# EAGLE schematic STEP800_proto_r3 (EAGLE 9.5.2)

## Sheet 1 of 3
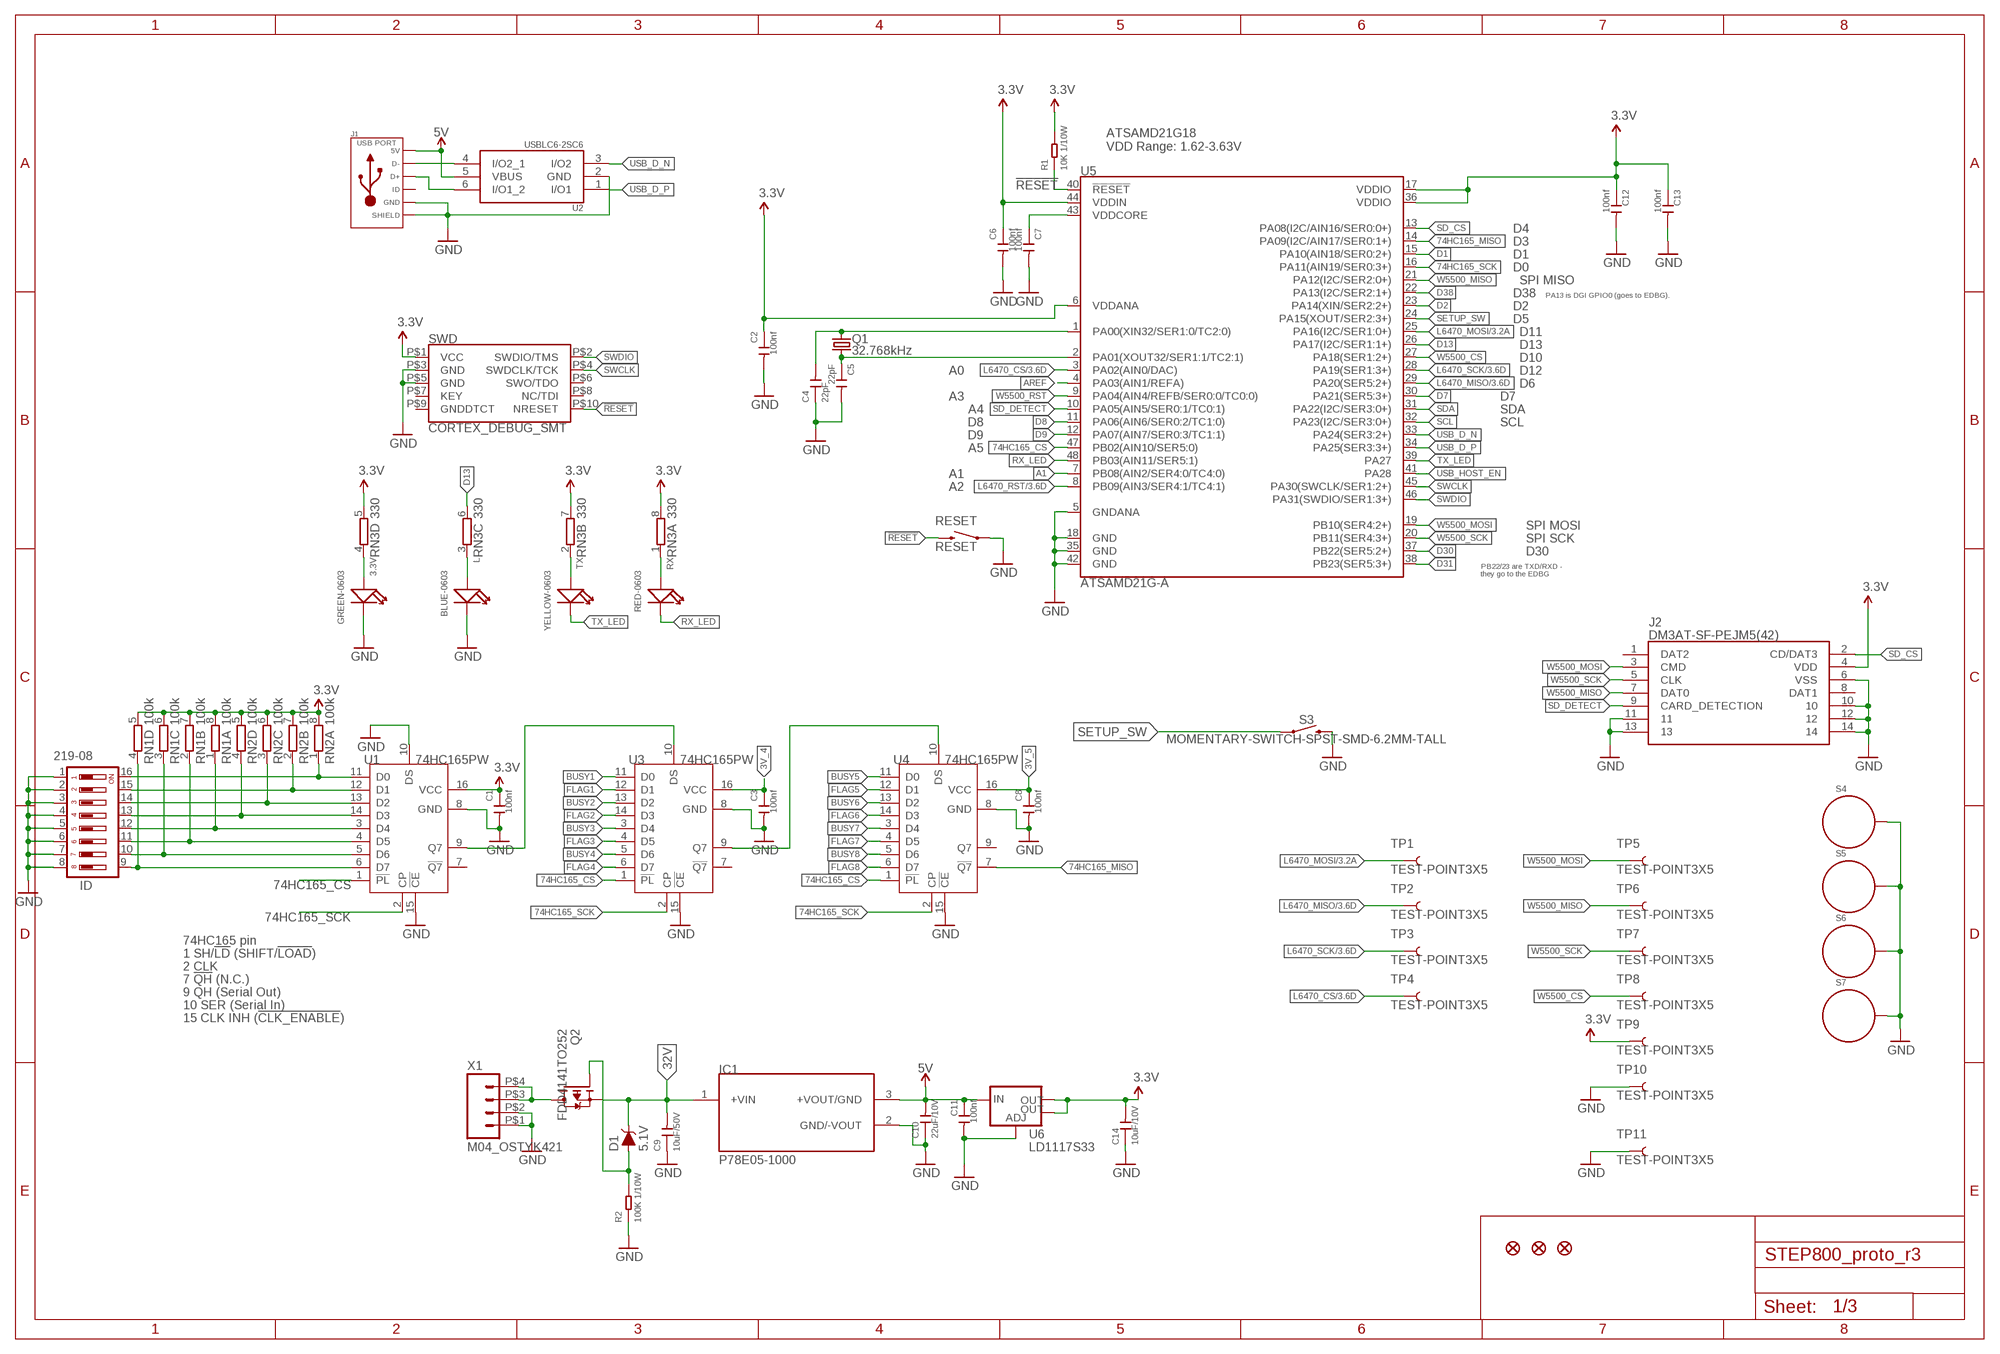
[diagram p0: schematic, sheet 1]

### Parts
3.3V  GREEN-0603  SMD-LED-CLEAR-GREEN(0603)  [LED-0603]
C1  100nf  CERAMIC-100NF-25V-10%-X7R(0402)  [C0402]
C2  100nf  CERAMIC-100NF-25V-10%-X7R(0402)  [C0402]
C3  100nf  CERAMIC-100NF-25V-10%-X7R(0402)  [C0402]
C4  22pF  CERAMIC-15PF-50V-5%-NPO(0402)  [C0402]
C5  22pF  CERAMIC-15PF-50V-5%-NPO(0402)  [C0402]
C6  100nf  CERAMIC-100NF-25V-10%-X7R(0402)  [C0402]
C7  100nf  CERAMIC-100NF-25V-10%-X7R(0402)  [C0402]
C8  100nf  CERAMIC-100NF-25V-10%-X7R(0402)  [C0402]
C9  10uF/50V  CERAMIC-10UF-25V-10%-X5R(1206)  [C1206]
C10  22uF/10V  CERAMIC-22UF-16V-10%-X7R(1206)  [C1206]
C11  100nf  CERAMIC-100NF-25V-10%-X7R(0402)  [C0402]
C12  100nf  CERAMIC-100NF-25V-10%-X7R(0402)  [C0402]
C13  100nf  CERAMIC-100NF-25V-10%-X7R(0402)  [C0402]
C14  10uF/10V  CERAMIC-10UF-10V-(-20%～+80%)-Y5V(0805)  [C0805]
D1  5.1V  DIODE-ZENER-MM3Z3V3T1G  [SOD-323]
FD1  FIDUCIAL1X2  [FIDUCIAL-1X2]
FD2  FIDUCIAL1X2  [FIDUCIAL-1X2]
FD3  FIDUCIAL1X2  [FIDUCIAL-1X2]
IC1  P78E05-1000  [CONV_P78E05-1000]
ID  219-08  [CTS-219-08]
J1  USB_MICRO_10118193-0001LF  [MICROUSB-FCI-PBAN]
J2  DM3AT-SF-PEJM5(42)  [DM3ATSFPEJM542]
L  BLUE-0603  SMD-LED-CLEAR-BLUE(0603)  [LED-0603]
Q1  32.768kHz  CRYSTALFC-135  [FC-135]
Q2  FDD4141TO252  [TO252]
R1  10K 1/10W  SMD-RES-10K-5%-1/10W(0603)  [R0603]
R2  100K 1/10W  SMD-RES-100K-5%-1/10W(0603)  [R0603]
RESET  RESET  SWITCH-MOMENTARY-2SMD  [TACTILE-SWITCH-SMD]
RN1  100k  4R-NCAY16_LONG_W  [CAY16_LONG_W]
RN2  100k  4R-NCAY16_LONG_W  [CAY16_LONG_W]
RN3  330  4R-NCAY16_LONG_W  [CAY16_LONG_W]
RX  RED-0603  LED-SMD-RED-DIFFUSED(0603)  [LED-0603]
S3  MOMENTARY-SWITCH-SPST-SMD-6.2MM-TALL  [TACTILE_SWITCH_SMD_6.2MM_TALL]
S4  STANDOFF_ELECTRICAL  [STANDOFF-ELECTRICAL]
S5  STANDOFF_ELECTRICAL  [STANDOFF-ELECTRICAL]
S6  STANDOFF_ELECTRICAL  [STANDOFF-ELECTRICAL]
S7  STANDOFF_ELECTRICAL  [STANDOFF-ELECTRICAL]
SWD  CORTEX_DEBUG_SMT  [20021121-00010C4LF]
TP1  TEST-POINT3X5  [PAD.03X.05]
TP2  TEST-POINT3X5  [PAD.03X.05]
TP3  TEST-POINT3X5  [PAD.03X.05]
TP4  TEST-POINT3X5  [PAD.03X.05]
TP5  TEST-POINT3X5  [PAD.03X.05]
TP6  TEST-POINT3X5  [PAD.03X.05]
TP7  TEST-POINT3X5  [PAD.03X.05]
TP8  TEST-POINT3X5  [PAD.03X.05]
TP9  TEST-POINT3X5  [PAD.03X.05]
TP10  TEST-POINT3X5  [PAD.03X.05]
TP11  TEST-POINT3X5  [PAD.03X.05]
TX  YELLOW-0603  SMD-LED-CLEAR-YELLOW(0603)  [LED-0603]
U1  74HC165PW  [TSSOP16]
U2  USBLC6-2SC6  [SOT23-6L]
U3  74HC165PW  [TSSOP16]
U4  74HC165PW  [TSSOP16]
U5  ATSAMD21G-A  [TQFP-48]
U6  LD1117S33  V_REG_LM1117SOT223  [SOT223]
X1  M04_OSTYK421  [OSTYK42104030]

### Nets
3.3V [GND_]: C1.1 C2.1 C6.1 C12.1 C13.1 C14.2 J2.4(VDD) R1.2 RN1.5 RN1.6 RN1.7 RN1.8 RN2.5 RN2.6 RN2.7 RN2.8 RN3.5 RN3.7 RN3.8 SWD.P$1(VCC) TP9.P$1 U1.16(VCC) U5.6(VDDANA) U5.17(VDDIO) U5.36(VDDIO) U5.44(VDDIN) U6.2(OUT) U6.4(OUT) ; also sheet 2,3
3V_4 [GND_]: C3.1 U3.16(VCC) ; also sheet 3
3V_5 [GND_]: C8.1 U4.16(VCC) ; also sheet 3
5V: C10.2 C11.1 IC1.3(+VOUT/GND) J1.1(5V) U2.5(VBUS) U6.3(IN) ; also sheet 3
32V: C9.2 D1.C IC1.1(+VIN) Q2.2(S) ; also sheet 3
74HC165_CS: U1.1(!PL) U3.1(!PL) U4.1(!PL) U5.47(PB02(AIN10/SER5:0))
74HC165_MISO: U4.7(!Q7) U5.14(PA09(I2C/AIN17/SER0:1+))
74HC165_SCK: U1.2(CP) U3.2(CP) U4.2(CP) U5.16(PA11(AIN19/SER0:3+))
!RESET: R1.1 RESET.3 SWD.P$10(NRESET) U5.40(!RESET!)
A1: U5.7(PB08(AIN2/SER4:0/TC4:0))
AREF: U5.4(PA03(AIN1/REFA))
BUSY1: U3.11(D0) ; also sheet 3
BUSY2: U3.13(D2) ; also sheet 3
BUSY3: U3.3(D4) ; also sheet 3
BUSY4: U3.5(D6) ; also sheet 3
BUSY5: U4.11(D0) ; also sheet 3
BUSY6: U4.13(D2) ; also sheet 3
BUSY7: U4.3(D4) ; also sheet 3
BUSY8: U4.5(D6) ; also sheet 3
D1: U5.15(PA10(AIN18/SER0:2+))
D2: U5.23(PA14(XIN/SER2:2+))
D7: U5.30(PA21(SER5:3+))
D8: U5.11(PA06(AIN6/SER0:2/TC1:0))
D9: U5.12(PA07(AIN7/SER0:3/TC1:1))
D13: RN3.6 U5.26(PA17(I2C/SER1:1+))
D30: U5.37(PB22(SER5:2+))
D31: U5.38(PB23(SER5:3+))
D38: U5.22(PA13(I2C/SER2:1+))
D+1: J1.3(D+) U2.6(I/O1_2)
FLAG1: U3.12(D1) ; also sheet 3
FLAG2: U3.14(D3) ; also sheet 3
FLAG3: U3.4(D5) ; also sheet 3
FLAG4: U3.6(D7) ; also sheet 3
FLAG5: U4.12(D1) ; also sheet 3
FLAG6: U4.14(D3) ; also sheet 3
FLAG7: U4.4(D5) ; also sheet 3
FLAG8: U4.6(D7) ; also sheet 3
GND: 3.3V.- C1.2 C2.2 C3.2 C4.1 C5.2 C6.2 C7.2 C8.2 C9.1 C10.1 C11.2 C12.2 C13.2 C14.1 IC1.2(GND/-VOUT) ID.1 ID.2 ID.3 ID.4 ID.5 ID.6 ID.7 ID.8 J1.5(GND) J1.S1(SLD) J1.S2(SLD) J1.S3(SLD) J1.S4(SLD) J1.S5(SLD) J1.S6(SLD) J1.S7(SLD) J1.S8(SLD) J2.6(VSS) J2.10 J2.11 J2.12 J2.13 J2.14 L.- R2.1 RESET.1 S3.B2 S4.P1 S5.P1 S6.P1 S7.P1 SWD.P$3(GND) SWD.P$5(GND) TP10.P$1 TP11.P$1 U1.8(GND) U1.10(DS) U1.15(!CE) U2.2(GND) U3.8(GND) U3.15(!CE) U4.8(GND) U4.15(!CE) U5.5(GNDANA) U5.18(GND) U5.35(GND) U5.42(GND) U6.1(ADJ) X1.P$1 X1.P$2 ; also sheet 2,3
L6470_CS: TP4.P$1 U5.3(PA02(AIN0/DAC)) ; also sheet 3
L6470_MISO: TP2.P$1 U5.29(PA20(SER5:2+)) ; also sheet 3
L6470_MOSI: TP1.P$1 U5.25(PA16(I2C/SER1:0+)) ; also sheet 3
L6470_RST: U5.8(PB09(AIN3/SER4:1/TC4:1)) ; also sheet 3
L6470_SCK: TP3.P$1 U5.28(PA19(SER1:3+)) ; also sheet 3
N$3: C4.2 Q1.P$2 U5.1(PA00(XIN32/SER1:0/TC2:0))
N$10: ID.16 RN2.1 U1.11(D0)
N$11: D1.A Q2.1(G) R2.2
N$12: ID.15 RN2.2 U1.12(D1)
N$13: ID.14 RN2.3 U1.13(D2)
N$14: C5.1 Q1.P$1 U5.2(PA01(XOUT32/SER1:1/TC2:1))
N$15: U1.9(Q7) U3.10(DS)
N$16: RN3.1 RX.+
N$17: ID.13 RN2.4 U1.14(D3)
N$18: ID.12 RN1.1 U1.3(D4)
N$19: ID.11 RN1.2 U1.4(D5)
N$25: RN3.2 TX.+
N$26: L.+ RN3.3
N$27: 3.3V.+ RN3.4
N$28: J1.2(D-) U2.4(I/O2_1)
N$33: ID.10 RN1.3 U1.5(D6)
N$34: U3.9(Q7) U4.10(DS)
N$38: ID.9 RN1.4 U1.6(D7)
RX_LED: RX.- U5.48(PB03(AIN11/SER5:1))
SCL: U5.32(PA23(I2C/SER3:0+))
SD_CS: J2.2(CD/DAT3) U5.13(PA08(I2C/AIN16/SER0:0+))
SD_DETECT: J2.9(CARD_DETECTION) U5.10(PA05(AIN5/SER0:1/TC0:1))
SDA: U5.31(PA22(I2C/SER3:0+))
SETUP_SW: S3.A2 U5.24(PA15(XOUT/SER2:3+))
SWCLK: SWD.P$4(SWDCLK/TCK) U5.45(PA30(SWCLK/SER1:2+))
SWDIO: SWD.P$2(SWDIO/TMS) U5.46(PA31(SWDIO/SER1:3+))
TX_LED: TX.- U5.39(PA27)
USB_D_N: U2.3(I/O2) U5.33(PA24(SER3:2+))
USB_D_P: U2.1(I/O1) U5.34(PA25(SER3:3+))
USB_HOST_EN: U5.41(PA28)
VDDCORE1: C7.1 U5.43(VDDCORE)
VRAW: Q2.3(D) X1.P$3 X1.P$4
W5500_CS: TP8.P$1 U5.27(PA18(SER1:2+)) ; also sheet 2
W5500_MISO: J2.7(DAT0) TP6.P$1 U5.21(PA12(I2C/SER2:0+)) ; also sheet 2
W5500_MOSI: J2.3(CMD) TP5.P$1 U5.19(PB10(SER4:2+)) ; also sheet 2
W5500_RST: U5.9(PA04(AIN4/REFB/SER0:0/TC0:0)) ; also sheet 2
W5500_SCK: J2.5(CLK) TP7.P$1 U5.20(PB11(SER4:3+)) ; also sheet 2
Unconnected: J1.4(ID) J2.1(DAT2) J2.8(DAT1) SWD.P$6(SWO/TDO) SWD.P$7(KEY) SWD.P$8(NC/TDI) SWD.P$9(GNDDTCT) U1.7(!Q7) U3.7(!Q7) U4.9(Q7)

### Notes on the sheet
- ATSAMD21G18
  VDD Range: 1.62-3.63V
- D4
- D3
- D1
- D0
- SPI MISO
- D38 | PA13 is DGI GPIO0 (goes to EDBG).
- D2
- D5
- D11
- D13
- D10
- A0 | D12
- D6
- A3 | D7
- A4 | SDA
- D8 | SCL
- D9
- A5
- A1
- A2
- SPI MOSI
- SPI SCK
- D30
- PB22/23 are TXD/RXD - 
  they go to the EDBG
- 74HC165 pin
- 1 SH/!LD! (SHIFT/!LOAD!)
- 2 CLK
- 7 !QH! (N.C.)
- 9 QH (Serial Out)
- 10 SER (Serial In)
- 15 CLK INH (!CLK_ENABLE!)

## Sheet 2 of 3
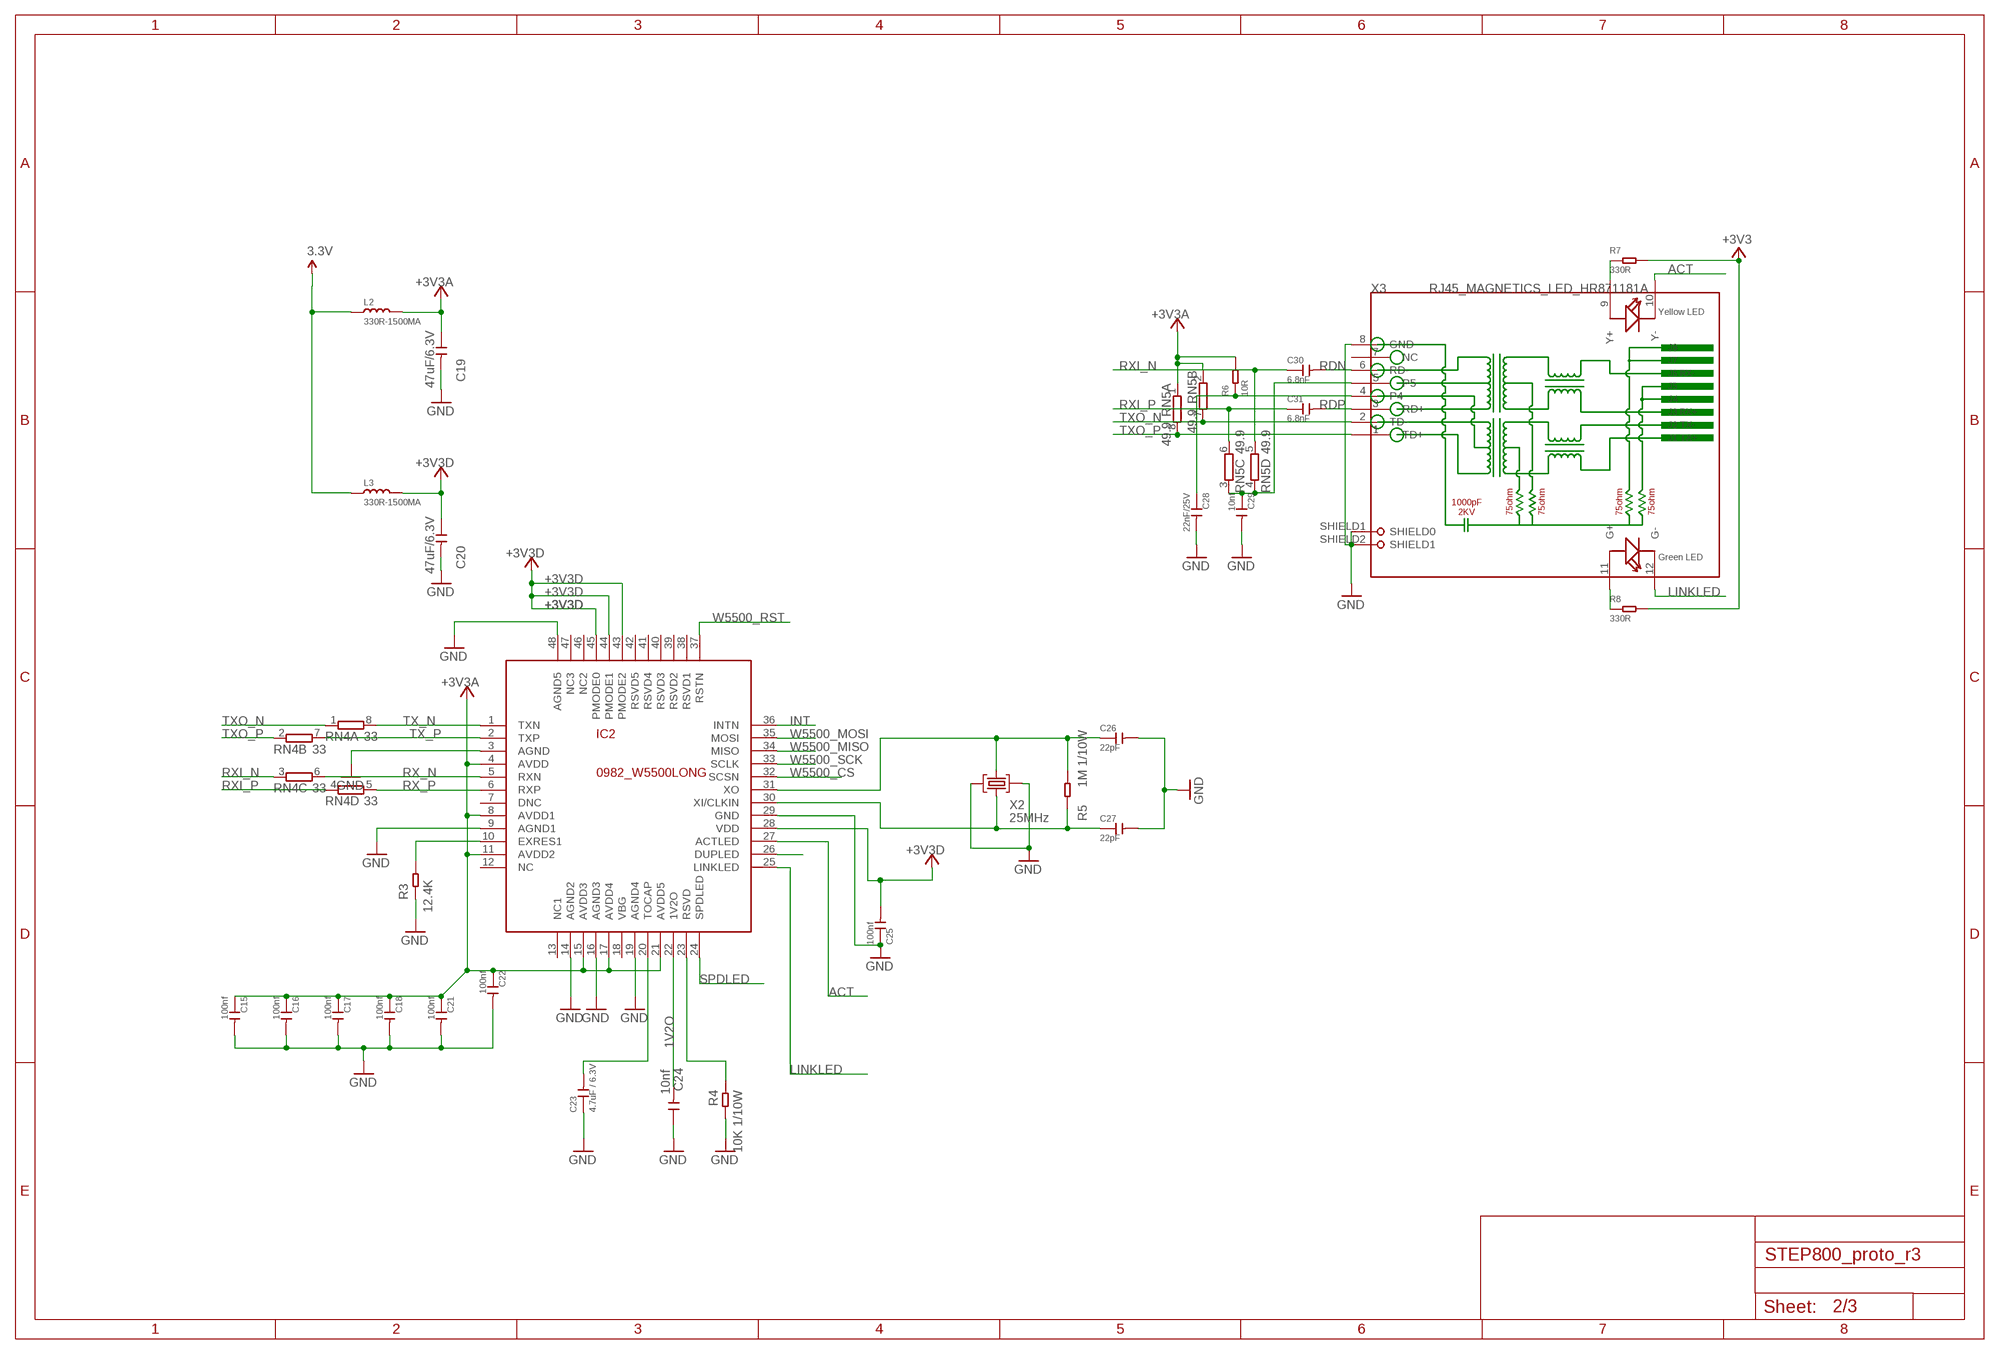
[diagram p1: schematic, sheet 2]

### Parts
C15  100nf  CERAMIC-100NF-25V-10%-X7R(0402)  [C0402]
C16  100nf  CERAMIC-100NF-25V-10%-X7R(0402)  [C0402]
C17  100nf  CERAMIC-100NF-25V-10%-X7R(0402)  [C0402]
C18  100nf  CERAMIC-100NF-25V-10%-X7R(0402)  [C0402]
C19  47uF/6.3V  CERAMIC-100UF-6.3V-20%-X5R(1206)  [C1206]
C20  47uF/6.3V  CERAMIC-100UF-6.3V-20%-X5R(1206)  [C1206]
C21  100nf  CERAMIC-100NF-25V-10%-X7R(0402)  [C0402]
C22  100nf  CERAMIC-100NF-25V-10%-X7R(0402)  [C0402]
C23  4.7uF / 6.3V  CERAMIC-4.7UF-10V-10%-X5R(0603)  [C0603]
C24  10nf  CERAMIC-10NF-50V-10%-X7R(0402)  [C0402]
C25  100nf  CERAMIC-100NF-25V-10%-X7R(0402)  [C0402]
C26  22pF  CERAMIC-15PF-50V-5%-NPO(0402)  [C0402]
C27  22pF  CERAMIC-15PF-50V-5%-NPO(0402)  [C0402]
C28  22nF/25V  CERAMIC-22NF-50V-10%-X7R(0402)  [C0402]
C29  10nf  CERAMIC-10NF-50V-10%-X7R(0402)  [C0402]
C30  6.8nF  CERAMIC-4.7NF-50V-10%-X7R(0402)  [C0402]
C31  6.8nF  CERAMIC-4.7NF-50V-10%-X7R(0402)  [C0402]
IC2  0982_W5500LONG  [TQFP48-LONG]
L2  330R-1500MA  SMD-FERRITE-BEAD-330R-1500MA(0805)'0805'  [L0805]
L3  330R-1500MA  SMD-FERRITE-BEAD-330R-1500MA(0805)'0805'  [L0805]
R3  12.4K  SMD-RES-12K-1%-1/10W(0603)  [R0603]
R4  10K 1/10W  SMD-RES-10K-5%-1/10W(0603)  [R0603]
R5  1M 1/10W  SMD-RES-1M-5%-1/10W(0603)  [R0603]
R6  10R  SMD-RES-10R-5%-1/10W(0603)  [R0603]
R7  330R  SMD-RES-330R-1%-1/10W(0603)  [R0603]
R8  330R  SMD-RES-330R-1%-1/10W(0603)  [R0603]
RN4  33  4R-NCAY16_LONG_W  [CAY16_LONG_W]
RN5  49.9  4R-NCAY16_LONG_W  [CAY16_LONG_W]
X2  25MHz  CRYSTAL-3.2-2.5  [CRYSTAL-3.2-2.5]
X3  RJ45_MAGNETICS_LED_HR871181A  [HR871181A]

### Nets
1V2O: C24.2 IC2.22(1V2O)
3.3V [GND_]: L2.1 L3.1 R7.2 R8.2 ; supply symbol labelled +3V3 ; also sheet 1,3
+3V3A [POWER_]: C15.1 C16.1 C17.1 C18.1 C19.1 C21.1 C22.1 IC2.4(AVDD) IC2.8(AVDD1) IC2.11(AVDD2) IC2.15(AVDD3) IC2.17(AVDD4) IC2.21(AVDD5) L2.2 R6.2 RN5.1 RN5.2
+3V3D: C20.1 C25.2 IC2.28(VDD) IC2.43(PMODE2) IC2.44(PMODE1) IC2.45(PMODE0) L3.2
ACT: IC2.27(ACTLED) X3.10(Y-)
FDXLED1: IC2.26(DUPLED)
GND: C15.2 C16.2 C17.2 C18.2 C19.2 C20.2 C21.2 C22.2 C23.1 C24.1 C25.1 C26.2 C27.2 C28.2 C29.2 IC2.3(AGND) IC2.9(AGND1) IC2.14(AGND2) IC2.16(AGND3) IC2.19(AGND4) IC2.29(GND) IC2.48(AGND5) R3.1 R4.1 X2.2(GND) X2.4(GND) X3.8(GND) X3.SHIELD1(SHIELD0) X3.SHIELD2(SHIELD1) ; also sheet 1,3
INT: IC2.36(INTN)
LINKLED: IC2.25(LINKLED) X3.12(G-)
N$1: C26.1 IC2.31(XO) R5.1 X2.3(C2)
N$2: IC2.23(RSVD) R4.2
N$4: IC2.10(EXRES1) R3.2
N$5: C23.2 IC2.20(TOCAP)
N$6: C28.1 R6.1 X3.4
N$7: C29.1 RN5.3 RN5.4 X3.5
N$8: R7.1 X3.9(Y+)
N$9: R8.1 X3.11(G+)
OSC2E1: C27.1 IC2.30(XI/CLKIN) R5.2 X2.1(C1)
RDN: C30.2 X3.6(RD-)
RDP: C31.2 X3.3(RD+)
RX_N: IC2.5(RXN) RN4.6
RX_P: IC2.6(RXP) RN4.5
RXI_N: C30.1 RN4.3 RN5.5
RXI_P: C31.1 RN4.4 RN5.6
SPDLED: IC2.24(SPDLED)
TX_N: IC2.1(TXN) RN4.8
TX_P: IC2.2(TXP) RN4.7
TXO_N: RN4.1 RN5.7 X3.2(TD-)
TXO_P: RN4.2 RN5.8 X3.1(TD+)
W5500_CS: IC2.32(SCSN) ; also sheet 1
W5500_MISO: IC2.34(MISO) ; also sheet 1
W5500_MOSI: IC2.35(MOSI) ; also sheet 1
W5500_RST: IC2.37(RSTN) ; also sheet 1
W5500_SCK: IC2.33(SCLK) ; also sheet 1
Unconnected: IC2.7(DNC) IC2.13(NC1) IC2.18(VBG) IC2.41(RSVD4) IC2.42(RSVD5) IC2.46(NC2) IC2.47(NC3) X3.7(NC)

## Sheet 3 of 3
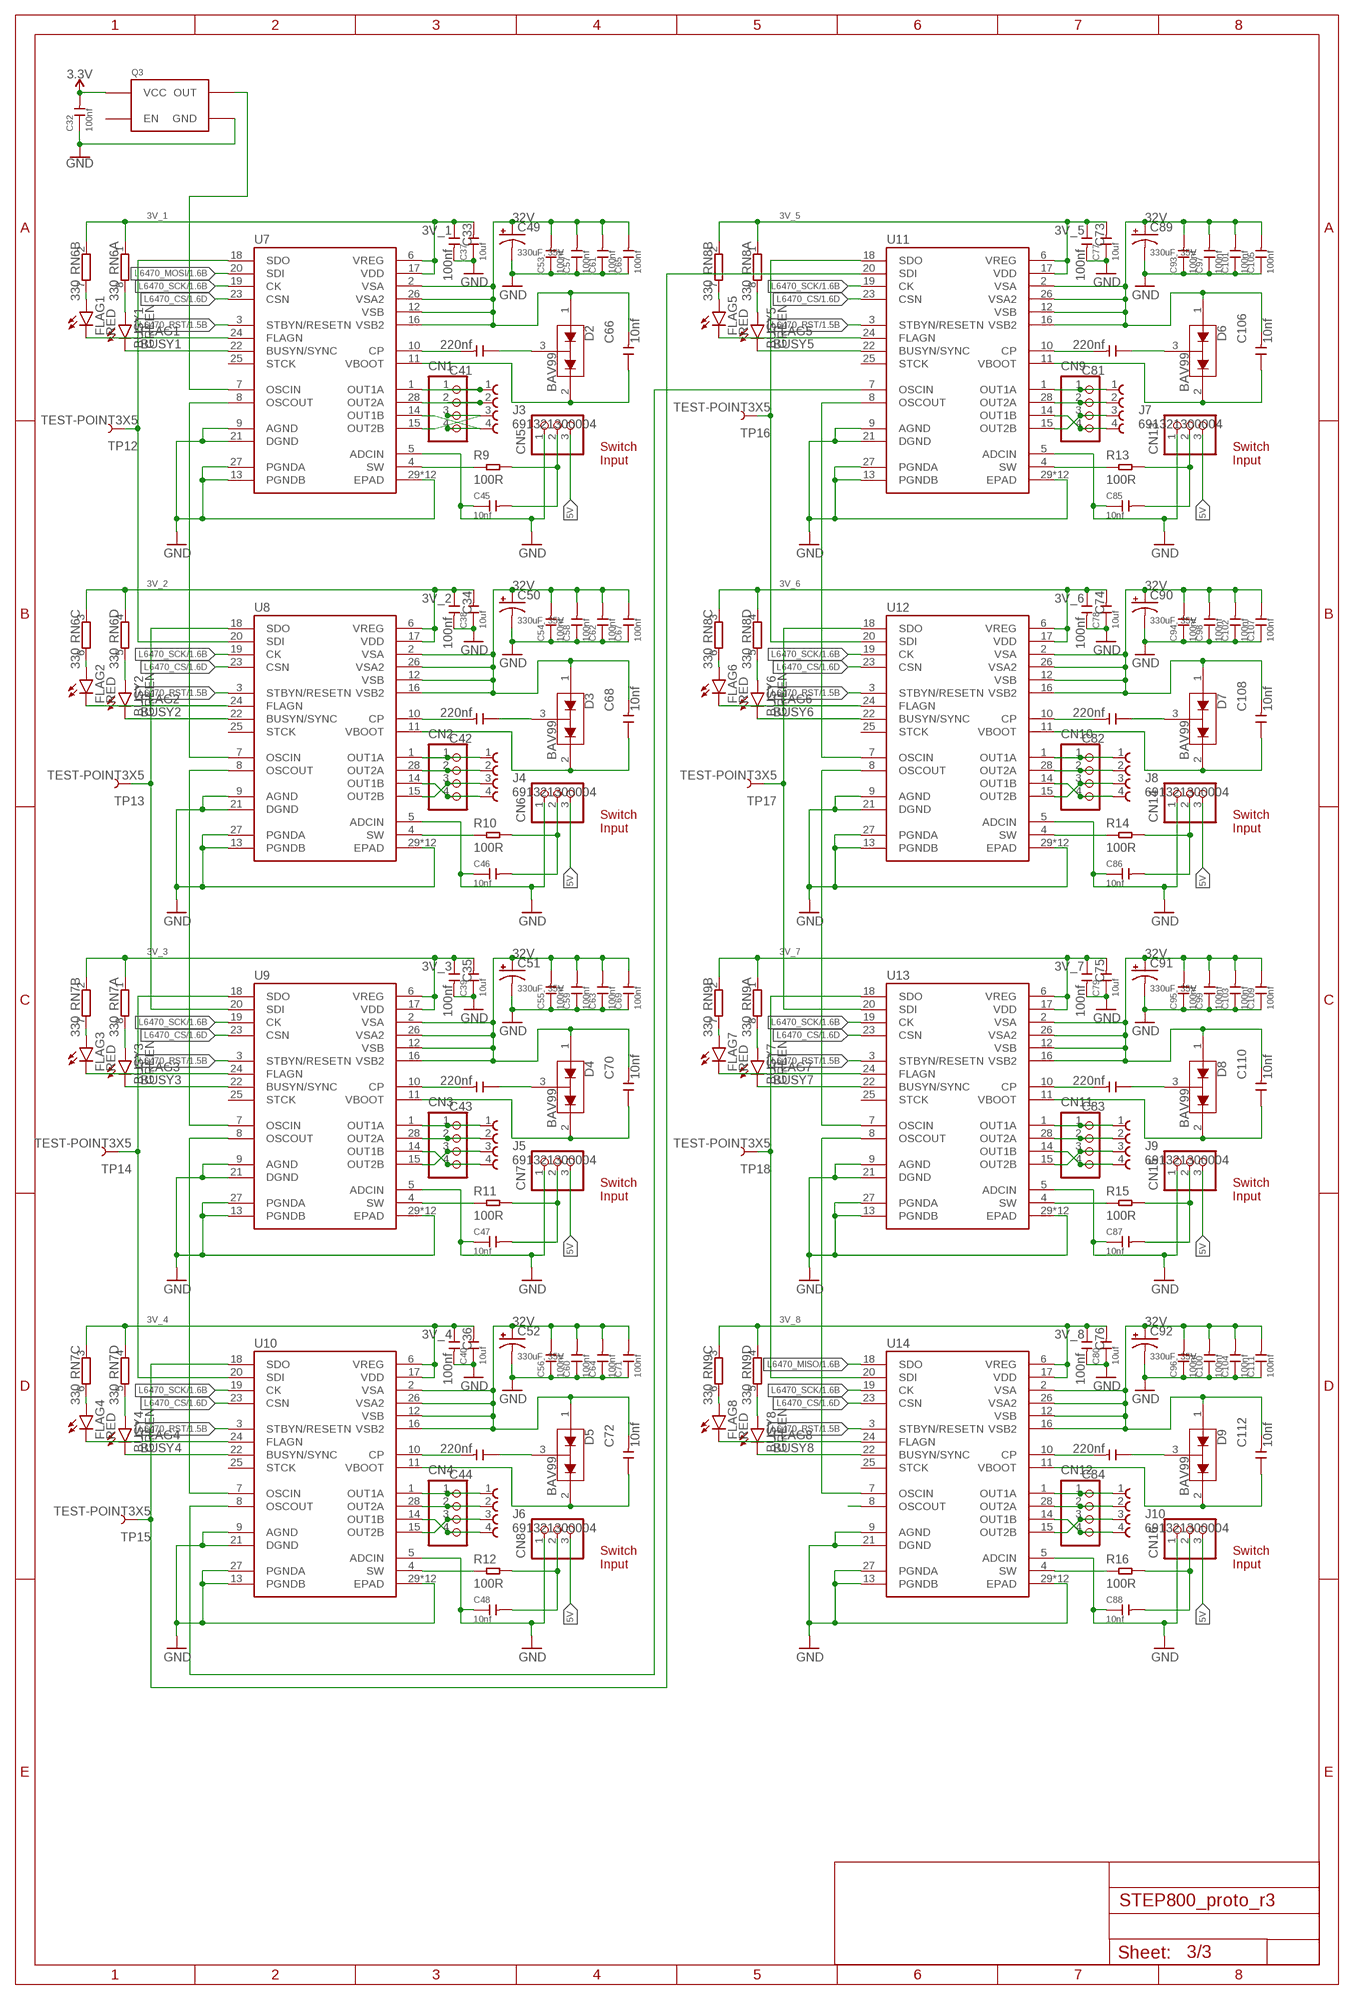
[diagram p2: schematic, sheet 3]

### Parts
BUSY1  GREEN  LED-GREEN0603  [LED-0603]
BUSY2  GREEN  LED-GREEN0603  [LED-0603]
BUSY3  GREEN  LED-GREEN0603  [LED-0603]
BUSY4  GREEN  LED-GREEN0603  [LED-0603]
BUSY5  GREEN  LED-GREEN0603  [LED-0603]
BUSY6  GREEN  LED-GREEN0603  [LED-0603]
BUSY7  GREEN  LED-GREEN0603  [LED-0603]
BUSY8  GREEN  LED-GREEN0603  [LED-0603]
C32  100nf  CERAMIC-100NF-25V-10%-X7R(0402)  [C0402]
C33  100nf  CERAMIC-100NF-25V-10%-X7R(0402)  [C0402]
C34  100nf  CERAMIC-100NF-25V-10%-X7R(0402)  [C0402]
C35  100nf  CERAMIC-100NF-25V-10%-X7R(0402)  [C0402]
C36  100nf  CERAMIC-100NF-25V-10%-X7R(0402)  [C0402]
C37  10uf  CERAMIC-10UF-25V-10%-X5R(0805)  [C0805]
C38  10uf  CERAMIC-10UF-25V-10%-X5R(0805)  [C0805]
C39  10uf  CERAMIC-10UF-25V-10%-X5R(0805)  [C0805]
C40  10uf  CERAMIC-10UF-25V-10%-X5R(0805)  [C0805]
C41  220nf  CERAMIC-220NF-25V-10%-X7R(0603)  [C0603]
C42  220nf  CERAMIC-220NF-25V-10%-X7R(0603)  [C0603]
C43  220nf  CERAMIC-220NF-25V-10%-X7R(0603)  [C0603]
C44  220nf  CERAMIC-220NF-25V-10%-X7R(0603)  [C0603]
C45  10nf  CERAMIC-10NF-50V-10%-X7R(0402)  [C0402]
C46  10nf  CERAMIC-10NF-50V-10%-X7R(0402)  [C0402]
C47  10nf  CERAMIC-10NF-50V-10%-X7R(0402)  [C0402]
C48  10nf  CERAMIC-10NF-50V-10%-X7R(0402)  [C0402]
C49  330uF, 35V  C_POLD10  [NICHICON_D10]
C50  330uF, 35V  C_POLD10  [NICHICON_D10]
C51  330uF, 35V  C_POLD10  [NICHICON_D10]
C52  330uF, 35V  C_POLD10  [NICHICON_D10]
C53  100nf  CERAMIC-100NF-50V-10%-X7R(0603)  [C0603]
C54  100nf  CERAMIC-100NF-50V-10%-X7R(0603)  [C0603]
C55  100nf  CERAMIC-100NF-50V-10%-X7R(0603)  [C0603]
C56  100nf  CERAMIC-100NF-50V-10%-X7R(0603)  [C0603]
C57  100nf  CERAMIC-100NF-50V-10%-X7R(0603)  [C0603]
C58  100nf  CERAMIC-100NF-50V-10%-X7R(0603)  [C0603]
C59  100nf  CERAMIC-100NF-50V-10%-X7R(0603)  [C0603]
C60  100nf  CERAMIC-100NF-50V-10%-X7R(0603)  [C0603]
C61  100nf  CERAMIC-100NF-50V-10%-X7R(0603)  [C0603]
C62  100nf  CERAMIC-100NF-50V-10%-X7R(0603)  [C0603]
C63  100nf  CERAMIC-100NF-50V-10%-X7R(0603)  [C0603]
C64  100nf  CERAMIC-100NF-50V-10%-X7R(0603)  [C0603]
C65  100nf  CERAMIC-100NF-50V-10%-X7R(0603)  [C0603]
C66  10nf  CERAMIC-10NF-50V-10%-X7R(0402)  [C0402]
C67  100nf  CERAMIC-100NF-50V-10%-X7R(0603)  [C0603]
C68  10nf  CERAMIC-10NF-50V-10%-X7R(0402)  [C0402]
C69  100nf  CERAMIC-100NF-50V-10%-X7R(0603)  [C0603]
C70  10nf  CERAMIC-10NF-50V-10%-X7R(0402)  [C0402]
C71  100nf  CERAMIC-100NF-50V-10%-X7R(0603)  [C0603]
C72  10nf  CERAMIC-10NF-50V-10%-X7R(0402)  [C0402]
C73  100nf  CERAMIC-100NF-25V-10%-X7R(0402)  [C0402]
C74  100nf  CERAMIC-100NF-25V-10%-X7R(0402)  [C0402]
C75  100nf  CERAMIC-100NF-25V-10%-X7R(0402)  [C0402]
C76  100nf  CERAMIC-100NF-25V-10%-X7R(0402)  [C0402]
C77  10uf  CERAMIC-10UF-25V-10%-X5R(0805)  [C0805]
C78  10uf  CERAMIC-10UF-25V-10%-X5R(0805)  [C0805]
C79  10uf  CERAMIC-10UF-25V-10%-X5R(0805)  [C0805]
C80  10uf  CERAMIC-10UF-25V-10%-X5R(0805)  [C0805]
C81  220nf  CERAMIC-220NF-25V-10%-X7R(0603)  [C0603]
C82  220nf  CERAMIC-220NF-25V-10%-X7R(0603)  [C0603]
C83  220nf  CERAMIC-220NF-25V-10%-X7R(0603)  [C0603]
C84  220nf  CERAMIC-220NF-25V-10%-X7R(0603)  [C0603]
C85  10nf  CERAMIC-10NF-50V-10%-X7R(0402)  [C0402]
C86  10nf  CERAMIC-10NF-50V-10%-X7R(0402)  [C0402]
C87  10nf  CERAMIC-10NF-50V-10%-X7R(0402)  [C0402]
C88  10nf  CERAMIC-10NF-50V-10%-X7R(0402)  [C0402]
C89  330uF, 35V  C_POLD10  [NICHICON_D10]
C90  330uF, 35V  C_POLD10  [NICHICON_D10]
C91  330uF, 35V  C_POLD10  [NICHICON_D10]
C92  330uF, 35V  C_POLD10  [NICHICON_D10]
C93  100nf  CERAMIC-100NF-50V-10%-X7R(0603)  [C0603]
C94  100nf  CERAMIC-100NF-50V-10%-X7R(0603)  [C0603]
C95  100nf  CERAMIC-100NF-50V-10%-X7R(0603)  [C0603]
C96  100nf  CERAMIC-100NF-50V-10%-X7R(0603)  [C0603]
C97  100nf  CERAMIC-100NF-50V-10%-X7R(0603)  [C0603]
C98  100nf  CERAMIC-100NF-50V-10%-X7R(0603)  [C0603]
C99  100nf  CERAMIC-100NF-50V-10%-X7R(0603)  [C0603]
C100  100nf  CERAMIC-100NF-50V-10%-X7R(0603)  [C0603]
C101  100nf  CERAMIC-100NF-50V-10%-X7R(0603)  [C0603]
C102  100nf  CERAMIC-100NF-50V-10%-X7R(0603)  [C0603]
C103  100nf  CERAMIC-100NF-50V-10%-X7R(0603)  [C0603]
C104  100nf  CERAMIC-100NF-50V-10%-X7R(0603)  [C0603]
C105  100nf  CERAMIC-100NF-50V-10%-X7R(0603)  [C0603]
C106  10nf  CERAMIC-10NF-50V-10%-X7R(0402)  [C0402]
C107  100nf  CERAMIC-100NF-50V-10%-X7R(0603)  [C0603]
C108  10nf  CERAMIC-10NF-50V-10%-X7R(0402)  [C0402]
C109  100nf  CERAMIC-100NF-50V-10%-X7R(0603)  [C0603]
C110  10nf  CERAMIC-10NF-50V-10%-X7R(0402)  [C0402]
C111  100nf  CERAMIC-100NF-50V-10%-X7R(0603)  [C0603]
C112  10nf  CERAMIC-10NF-50V-10%-X7R(0402)  [C0402]
CN1  B4B-XASK-1  [B4B-XASK-1]
CN2  B4B-XASK-1  [B4B-XASK-1]
CN3  B4B-XASK-1  [B4B-XASK-1]
CN4  B4B-XASK-1  [B4B-XASK-1]
CN5  B3B-XASK-1  [B3B-XASK-1]
CN6  B3B-XASK-1  [B3B-XASK-1]
CN7  B3B-XASK-1  [B3B-XASK-1]
CN8  B3B-XASK-1  [B3B-XASK-1]
CN9  B4B-XASK-1  [B4B-XASK-1]
CN10  B4B-XASK-1  [B4B-XASK-1]
CN11  B4B-XASK-1  [B4B-XASK-1]
CN12  B4B-XASK-1  [B4B-XASK-1]
CN13  B3B-XASK-1  [B3B-XASK-1]
CN14  B3B-XASK-1  [B3B-XASK-1]
CN15  B3B-XASK-1  [B3B-XASK-1]
CN16  B3B-XASK-1  [B3B-XASK-1]
D2  BAV99  [SOT23-3]
D3  BAV99  [SOT23-3]
D4  BAV99  [SOT23-3]
D5  BAV99  [SOT23-3]
D6  BAV99  [SOT23-3]
D7  BAV99  [SOT23-3]
D8  BAV99  [SOT23-3]
D9  BAV99  [SOT23-3]
FLAG1  RED  LED-RED0603  [LED-0603]
FLAG2  RED  LED-RED0603  [LED-0603]
FLAG3  RED  LED-RED0603  [LED-0603]
FLAG4  RED  LED-RED0603  [LED-0603]
FLAG5  RED  LED-RED0603  [LED-0603]
FLAG6  RED  LED-RED0603  [LED-0603]
FLAG7  RED  LED-RED0603  [LED-0603]
FLAG8  RED  LED-RED0603  [LED-0603]
J3  691321300004  [691321300004]
J4  691321300004  [691321300004]
J5  691321300004  [691321300004]
J6  691321300004  [691321300004]
J7  691321300004  [691321300004]
J8  691321300004  [691321300004]
J9  691321300004  [691321300004]
J10  691321300004  [691321300004]
Q3  CRYSTAL_OSC_SG5032  [SG5032]
R9  100R  SMD-RES-100R-5%-1/10W(0603)  [R0603]
R10  100R  SMD-RES-100R-5%-1/10W(0603)  [R0603]
R11  100R  SMD-RES-100R-5%-1/10W(0603)  [R0603]
R12  100R  SMD-RES-100R-5%-1/10W(0603)  [R0603]
R13  100R  SMD-RES-100R-5%-1/10W(0603)  [R0603]
R14  100R  SMD-RES-100R-5%-1/10W(0603)  [R0603]
R15  100R  SMD-RES-100R-5%-1/10W(0603)  [R0603]
R16  100R  SMD-RES-100R-5%-1/10W(0603)  [R0603]
RN6  330  4R-NCAY16_LONG_W  [CAY16_LONG_W]
RN7  330  4R-NCAY16_LONG_W  [CAY16_LONG_W]
RN8  330  4R-NCAY16_LONG_W  [CAY16_LONG_W]
RN9  330  4R-NCAY16_LONG_W  [CAY16_LONG_W]
TP12  TEST-POINT3X5  [PAD.03X.05]
TP13  TEST-POINT3X5  [PAD.03X.05]
TP14  TEST-POINT3X5  [PAD.03X.05]
TP15  TEST-POINT3X5  [PAD.03X.05]
TP16  TEST-POINT3X5  [PAD.03X.05]
TP17  TEST-POINT3X5  [PAD.03X.05]
TP18  TEST-POINT3X5  [PAD.03X.05]
U7  L6470_THERMALVIA  [HTSSOP28_VIA]
U8  L6470_THERMALVIA  [HTSSOP28_VIA]
U9  L6470_THERMALVIA  [HTSSOP28_VIA]
U10  L6470_THERMALVIA  [HTSSOP28_VIA]
U11  L6470_THERMALVIA  [HTSSOP28_VIA]
U12  L6470_THERMALVIA  [HTSSOP28_VIA]
U13  L6470_THERMALVIA  [HTSSOP28_VIA]
U14  L6470_THERMALVIA  [HTSSOP28_VIA]

### Nets
3.3V [GND_]: C32.2 Q3.4(VCC) ; also sheet 1,2
3V_1 [GND_]: C33.1 C37.2 RN6.1 RN6.2 U7.6(VREG) U7.17(VDD)
3V_2 [GND_]: C34.1 C38.2 RN6.3 RN6.4 U8.6(VREG) U8.17(VDD)
3V_3 [GND_]: C35.1 C39.2 RN7.1 RN7.2 U9.6(VREG) U9.17(VDD)
3V_4 [GND_]: C36.1 C40.2 RN7.3 RN7.4 U10.6(VREG) U10.17(VDD) ; also sheet 1
3V_5 [GND_]: C73.1 C77.2 RN8.1 RN8.2 U11.6(VREG) U11.17(VDD) ; also sheet 1
3V_6 [GND_]: C74.1 C78.2 RN8.3 RN8.4 U12.6(VREG) U12.17(VDD)
3V_7 [GND_]: C75.1 C79.2 RN9.1 RN9.2 U13.6(VREG) U13.17(VDD)
3V_8 [GND_]: C76.1 C80.2 RN9.3 RN9.4 U14.6(VREG) U14.17(VDD)
5V: CN5.3 CN6.3 CN7.3 CN8.3 CN13.3 CN14.3 CN15.3 CN16.3 ; also sheet 1
32V: C49.+ C50.+ C51.+ C52.+ C53.2 C54.2 C55.2 C56.2 C57.2 C58.2 C59.2 C60.2 C61.2 C62.2 C63.2 C64.2 C65.2 C66.2 C67.2 C68.2 C69.2 C70.2 C71.2 C72.2 C89.+ C90.+ C91.+ C92.+ C93.2 C94.2 C95.2 C96.2 C97.2 C98.2 C99.2 C100.2 C101.2 C102.2 C103.2 C104.2 C105.2 C106.2 C107.2 C108.2 C109.2 C110.2 C111.2 C112.2 D2.1(A1) D3.1(A1) D4.1(A1) D5.1(A1) D6.1(A1) D7.1(A1) D8.1(A1) D9.1(A1) U7.2(VSA) U7.12(VSB) U7.16(VSB2) U7.26(VSA2) U8.2(VSA) U8.12(VSB) U8.16(VSB2) U8.26(VSA2) U9.2(VSA) U9.12(VSB) U9.16(VSB2) U9.26(VSA2) U10.2(VSA) U10.12(VSB) U10.16(VSB2) U10.26(VSA2) U11.2(VSA) U11.12(VSB) U11.16(VSB2) U11.26(VSA2) U12.2(VSA) U12.12(VSB) U12.16(VSB2) U12.26(VSA2) U13.2(VSA) U13.12(VSB) U13.16(VSB2) U13.26(VSA2) U14.2(VSA) U14.12(VSB) U14.16(VSB2) U14.26(VSA2) ; also sheet 1
BUSY1: BUSY1.C U7.22(BUSYN/SYNC) ; also sheet 1
BUSY2: BUSY2.C U8.22(BUSYN/SYNC) ; also sheet 1
BUSY3: BUSY3.C U9.22(BUSYN/SYNC) ; also sheet 1
BUSY4: BUSY4.C U10.22(BUSYN/SYNC) ; also sheet 1
BUSY5: BUSY5.C U11.22(BUSYN/SYNC) ; also sheet 1
BUSY6: BUSY6.C U12.22(BUSYN/SYNC) ; also sheet 1
BUSY7: BUSY7.C U13.22(BUSYN/SYNC) ; also sheet 1
BUSY8: BUSY8.C U14.22(BUSYN/SYNC) ; also sheet 1
FLAG1: FLAG1.C U7.24(FLAGN) ; also sheet 1
FLAG2: FLAG2.C U8.24(FLAGN) ; also sheet 1
FLAG3: FLAG3.C U9.24(FLAGN) ; also sheet 1
FLAG4: FLAG4.C U10.24(FLAGN) ; also sheet 1
FLAG5: FLAG5.C U11.24(FLAGN) ; also sheet 1
FLAG6: FLAG6.C U12.24(FLAGN) ; also sheet 1
FLAG7: FLAG7.C U13.24(FLAGN) ; also sheet 1
FLAG8: FLAG8.C U14.24(FLAGN) ; also sheet 1
GND: C32.1 C33.2 C34.2 C35.2 C36.2 C37.1 C38.1 C39.1 C40.1 C45.1 C46.1 C47.1 C48.1 C49.- C50.- C51.- C52.- C53.1 C54.1 C55.1 C56.1 C57.1 C58.1 C59.1 C60.1 C61.1 C62.1 C63.1 C64.1 C65.1 C67.1 C69.1 C71.1 C73.2 C74.2 C75.2 C76.2 C77.1 C78.1 C79.1 C80.1 C85.1 C86.1 C87.1 C88.1 C89.- C90.- C91.- C92.- C93.1 C94.1 C95.1 C96.1 C97.1 C98.1 C99.1 C100.1 C101.1 C102.1 C103.1 C104.1 C105.1 C107.1 C109.1 C111.1 CN5.1 CN6.1 CN7.1 CN8.1 CN13.1 CN14.1 CN15.1 CN16.1 Q3.2(GND) U7.5(ADCIN) U7.9(AGND) U7.13(PGNDB) U7.21(DGND) U7.27(PGNDA) U7.29(EPAD) U7.VIA1(EPAD) U7.VIA2(EPAD) U7.VIA3(EPAD) U7.VIA4(EPAD) U7.VIA5(EPAD) U7.VIA6(EPAD) U7.VIA7(EPAD) U7.VIA8(EPAD) U7.VIA9(EPAD) U7.VIA10(EPAD) U7.VIA11(EPAD) U8.5(ADCIN) U8.9(AGND) U8.13(PGNDB) U8.21(DGND) U8.27(PGNDA) U8.29(EPAD) U8.VIA1(EPAD) U8.VIA2(EPAD) U8.VIA3(EPAD) U8.VIA4(EPAD) U8.VIA5(EPAD) U8.VIA6(EPAD) U8.VIA7(EPAD) U8.VIA8(EPAD) U8.VIA9(EPAD) U8.VIA10(EPAD) U8.VIA11(EPAD) U9.5(ADCIN) U9.9(AGND) U9.13(PGNDB) U9.21(DGND) U9.27(PGNDA) U9.29(EPAD) U9.VIA1(EPAD) U9.VIA2(EPAD) U9.VIA3(EPAD) U9.VIA4(EPAD) U9.VIA5(EPAD) U9.VIA6(EPAD) U9.VIA7(EPAD) U9.VIA8(EPAD) U9.VIA9(EPAD) U9.VIA10(EPAD) U9.VIA11(EPAD) U10.5(ADCIN) U10.9(AGND) U10.13(PGNDB) U10.21(DGND) U10.27(PGNDA) U10.29(EPAD) U10.VIA1(EPAD) U10.VIA2(EPAD) U10.VIA3(EPAD) U10.VIA4(EPAD) U10.VIA5(EPAD) U10.VIA6(EPAD) U10.VIA7(EPAD) U10.VIA8(EPAD) U10.VIA9(EPAD) U10.VIA10(EPAD) U10.VIA11(EPAD) U11.5(ADCIN) U11.9(AGND) U11.13(PGNDB) U11.21(DGND) U11.27(PGNDA) U11.29(EPAD) U11.VIA1(EPAD) U11.VIA2(EPAD) U11.VIA3(EPAD) U11.VIA4(EPAD) U11.VIA5(EPAD) U11.VIA6(EPAD) U11.VIA7(EPAD) U11.VIA8(EPAD) U11.VIA9(EPAD) U11.VIA10(EPAD) U11.VIA11(EPAD) U12.5(ADCIN) U12.9(AGND) U12.13(PGNDB) U12.21(DGND) U12.27(PGNDA) U12.29(EPAD) U12.VIA1(EPAD) U12.VIA2(EPAD) U12.VIA3(EPAD) U12.VIA4(EPAD) U12.VIA5(EPAD) U12.VIA6(EPAD) U12.VIA7(EPAD) U12.VIA8(EPAD) U12.VIA9(EPAD) U12.VIA10(EPAD) U12.VIA11(EPAD) U13.5(ADCIN) U13.9(AGND) U13.13(PGNDB) U13.21(DGND) U13.27(PGNDA) U13.29(EPAD) U13.VIA1(EPAD) U13.VIA2(EPAD) U13.VIA3(EPAD) U13.VIA4(EPAD) U13.VIA5(EPAD) U13.VIA6(EPAD) U13.VIA7(EPAD) U13.VIA8(EPAD) U13.VIA9(EPAD) U13.VIA10(EPAD) U13.VIA11(EPAD) U14.5(ADCIN) U14.9(AGND) U14.13(PGNDB) U14.21(DGND) U14.27(PGNDA) U14.29(EPAD) U14.VIA1(EPAD) U14.VIA2(EPAD) U14.VIA3(EPAD) U14.VIA4(EPAD) U14.VIA5(EPAD) U14.VIA6(EPAD) U14.VIA7(EPAD) U14.VIA8(EPAD) U14.VIA9(EPAD) U14.VIA10(EPAD) U14.VIA11(EPAD) ; also sheet 1,2
L6470_CS: U7.23(CSN) U8.23(CSN) U9.23(CSN) U10.23(CSN) U11.23(CSN) U12.23(CSN) U13.23(CSN) U14.23(CSN) ; also sheet 1
L6470_MISO: U14.18(SDO) ; also sheet 1
L6470_MOSI: U7.20(SDI) ; also sheet 1
L6470_RST: U7.3(STBYN/RESETN) U8.3(STBYN/RESETN) U9.3(STBYN/RESETN) U10.3(STBYN/RESETN) U11.3(STBYN/RESETN) U12.3(STBYN/RESETN) U13.3(STBYN/RESETN) U14.3(STBYN/RESETN) ; also sheet 1
L6470_SCK: U7.19(CK) U8.19(CK) U9.19(CK) U10.19(CK) U11.19(CK) U12.19(CK) U13.19(CK) U14.19(CK) ; also sheet 1
N$20: C41.2 U7.10(CP)
N$21: C41.1 D2.3(COM)
N$22: C66.1 D2.2(C2) U7.11(VBOOT)
N$23: R9.1 U7.4(SW)
N$24: BUSY1.A RN6.8
N$29: FLAG1.A RN6.7
N$30: C45.2 CN5.2 R9.2
N$31: CN1.1 J3.1 U7.1(OUT1A)
N$32: CN1.2 J3.2 U7.28(OUT2A)
N$35: CN1.4 J3.4 U7.14(OUT1B)
N$37: CN1.3 J3.3 U7.15(OUT2B)
N$39: TP12.P$1 U7.18(SDO) U8.20(SDI)
N$60: C42.2 U8.10(CP)
N$61: C42.1 D3.3(COM)
N$63: C68.1 D3.2(C2) U8.11(VBOOT)
N$64: R10.1 U8.4(SW)
N$65: BUSY2.A RN6.5
N$66: FLAG2.A RN6.6
N$67: C46.2 CN6.2 R10.2
N$68: CN2.1 J4.1 U8.1(OUT1A)
N$69: CN2.2 J4.2 U8.28(OUT2A)
N$70: CN2.4 J4.4 U8.14(OUT1B)
N$71: CN2.3 J4.3 U8.15(OUT2B)
N$73: TP13.P$1 U8.18(SDO) U9.20(SDI)
N$87: C43.2 U9.10(CP)
N$88: C43.1 D4.3(COM)
N$89: C70.1 D4.2(C2) U9.11(VBOOT)
N$90: R11.1 U9.4(SW)
N$91: BUSY3.A RN7.8
N$92: FLAG3.A RN7.7
N$93: C47.2 CN7.2 R11.2
N$94: CN3.1 J5.1 U9.1(OUT1A)
N$95: CN3.2 J5.2 U9.28(OUT2A)
N$96: CN3.4 J5.4 U9.14(OUT1B)
N$97: CN3.3 J5.3 U9.15(OUT2B)
N$99: TP14.P$1 U9.18(SDO) U10.20(SDI)
N$113: C44.2 U10.10(CP)
N$114: C44.1 D5.3(COM)
N$115: C72.1 D5.2(C2) U10.11(VBOOT)
N$116: R12.1 U10.4(SW)
N$117: BUSY4.A RN7.5
N$118: FLAG4.A RN7.6
N$119: C48.2 CN8.2 R12.2
N$120: CN4.1 J6.1 U10.1(OUT1A)
N$121: CN4.2 J6.2 U10.28(OUT2A)
N$122: CN4.4 J6.4 U10.14(OUT1B)
N$123: CN4.3 J6.3 U10.15(OUT2B)
N$125: TP15.P$1 U10.18(SDO) U11.20(SDI)
N$139: C81.2 U11.10(CP)
N$140: C81.1 D6.3(COM)
N$141: C106.1 D6.2(C2) U11.11(VBOOT)
N$145: R13.1 U11.4(SW)
N$146: BUSY5.A RN8.8
N$147: FLAG5.A RN8.7
N$148: C85.2 CN13.2 R13.2
N$149: CN9.1 J7.1 U11.1(OUT1A)
N$150: CN9.2 J7.2 U11.28(OUT2A)
N$151: CN9.4 J7.4 U11.14(OUT1B)
N$152: CN9.3 J7.3 U11.15(OUT2B)
N$154: TP16.P$1 U11.18(SDO) U12.20(SDI)
N$168: C82.2 U12.10(CP)
N$169: C82.1 D7.3(COM)
N$170: C108.1 D7.2(C2) U12.11(VBOOT)
N$171: R14.1 U12.4(SW)
N$172: BUSY6.A RN8.5
N$173: FLAG6.A RN8.6
N$174: C86.2 CN14.2 R14.2
N$175: CN10.1 J8.1 U12.1(OUT1A)
N$176: CN10.2 J8.2 U12.28(OUT2A)
N$177: CN10.4 J8.4 U12.14(OUT1B)
N$178: CN10.3 J8.3 U12.15(OUT2B)
N$180: TP17.P$1 U12.18(SDO) U13.20(SDI)
N$194: C83.2 U13.10(CP)
N$195: C83.1 D8.3(COM)
N$196: C110.1 D8.2(C2) U13.11(VBOOT)
N$197: R15.1 U13.4(SW)
N$198: BUSY7.A RN9.8
N$199: FLAG7.A RN9.7
N$200: C87.2 CN15.2 R15.2
N$201: CN11.1 J9.1 U13.1(OUT1A)
N$202: CN11.2 J9.2 U13.28(OUT2A)
N$203: CN11.4 J9.4 U13.14(OUT1B)
N$204: CN11.3 J9.3 U13.15(OUT2B)
N$206: TP18.P$1 U13.18(SDO) U14.20(SDI)
N$220: C84.2 U14.10(CP)
N$221: C84.1 D9.3(COM)
N$222: C112.1 D9.2(C2) U14.11(VBOOT)
N$223: R16.1 U14.4(SW)
N$224: BUSY8.A RN9.5
N$225: FLAG8.A RN9.6
N$226: C88.2 CN16.2 R16.2
N$227: CN12.1 J10.1 U14.1(OUT1A)
N$228: CN12.2 J10.2 U14.28(OUT2A)
N$229: CN12.4 J10.4 U14.14(OUT1B)
N$230: CN12.3 J10.3 U14.15(OUT2B)
OSCOUT2: U7.8(OSCOUT) U8.7(OSCIN)
OSCOUT4: U8.8(OSCOUT) U9.7(OSCIN)
OSCOUT6: U9.8(OSCOUT) U10.7(OSCIN)
OSCOUT8: U10.8(OSCOUT) U11.7(OSCIN)
OSCOUT10: U11.8(OSCOUT) U12.7(OSCIN)
OSCOUT12: U12.8(OSCOUT) U13.7(OSCIN)
OSCOUT14: U13.8(OSCOUT) U14.7(OSCIN)
OSCOUT16: U14.8(OSCOUT)
QGOUT1: Q3.3(OUT) U7.7(OSCIN)
Unconnected: Q3.1(EN) U7.25(STCK) U8.25(STCK) U9.25(STCK) U10.25(STCK) U11.25(STCK) U12.25(STCK) U13.25(STCK) U14.25(STCK)

### Notes on the sheet
- Switch
  Input
- Switch
  Input
- Switch
  Input
- Switch
  Input
- Switch
  Input
- Switch
  Input
- Switch
  Input
- Switch
  Input

## Power pins joined to a net without a drawn wire
NC: IC2.12(NC)
RSVD1: IC2.38(RSVD1)
RSVD2: IC2.39(RSVD2)
RSVD3: IC2.40(RSVD3)

## Library data of the parts
3.3V = Seeed-LED:SMD-LED-CLEAR-GREEN(0603): 304090043; MPN: 19-217-G7C-AN1P2-3T
BUSY1-BUSY8 = SparkFun-LED:LED-GREEN: Various green LEDs Green LEDs used in SFE Production 0603- DIO-00821 LARGE- DIO-00862 LILYPAD- DIO-09910; PROD_ID: DIO-00821
C1-C3 C6-C8 C11-C13 C15-C18 C21 C22 C25 C32-C36 C73-C76 = Seeed-Capacitor:CERAMIC-100NF-25V-10%-X7R(0402): 302010024; MPN: CC0402KRX7R8BB104
C4 C5 C26 C27 = Seeed-Capacitor:CERAMIC-15PF-50V-5%-NPO(0402): 302010041; MPN: GRM1555C1H150JA01D; VALUE: 15pf
C9 = OPL_Capacitor:CERAMIC-10UF-25V-10%-X5R(1206): 302010181; MPN: CC1206KKX5R8BB106; VALUE: 10uf
C10 = OPL_Capacitor:CERAMIC-22UF-16V-10%-X7R(1206): 302010182
C14 = OPL_Capacitor:CERAMIC-10UF-10V-(-20%～+80%)-Y5V(0805): 302010158; MPN: CC0805ZKY5V6BB106; VALUE: 10uf
C19 C20 = Seeed-Capacitor:CERAMIC-100UF-6.3V-20%-X5R(1206): 302010183; MPN: GRM31CR60J107ME39L; VALUE: 100uf
C23 = Seeed-Capacitor:CERAMIC-4.7UF-10V-10%-X5R(0603): 302010111; MPN: CC0603KRX5R6BB475; VALUE: 4.7uf
C24 C29 C45-C48 C66 C68 C70 C72 C85-C88 C106 C108 C110 C112 = Seeed-Capacitor:CERAMIC-10NF-50V-10%-X7R(0402): 302010006; MPN: CC0402KRX7R9BB103
C28 = Seeed-Capacitor:CERAMIC-22NF-50V-10%-X7R(0402): 302010242; MPN: CC0402KRX7R9BB223; VALUE: 22NF 50V
C30 C31 = Seeed-Capacitor:CERAMIC-4.7NF-50V-10%-X7R(0402): 302010261; MPN: CC0402KRX7R9BB472; VALUE: 4.7NF 50V
C37-C40 C77-C80 = Seeed-Capacitor:CERAMIC-10UF-25V-10%-X5R(0805): 302010178; MPN: CC0805KKX5R8BB106
C41-C44 C81-C84 = Seeed-Capacitor:CERAMIC-220NF-25V-10%-X7R(0603): 302010073; MPN: CC0603KRX7R8BB224
C49-C52 C89-C92 = _kantaParts:C_POL: Nippon Chemi-Con 3300uF/50V KMH50VSSN3300M P-01590 <http://akizukidenshi.com/catalog/g/gP-01590/>
C53-C65 C67 C69 C71 C93-C105 C107 C109 C111 = Seeed-Capacitor:CERAMIC-100NF-50V-10%-X7R(0603): 302010138; MPN: CC0603KRX7R9BB104
CN1-CN4 CN9-CN12 = jst-xa:B4B-XASK-1: Wire-to-Board 2.5mm pitch top mount connector Source: http://www.jst-mfg.com/product/pdf/jpn/XA1.pdf http://www.jst-mfg.com/product/detail.php?series=272
CN5-CN8 CN13-CN16 = jst-xa:B3B-XASK-1: Wire-to-Board 2.5mm pitch top mount connector Source: http://www.jst-mfg.com/product/pdf/jpn/XA1.pdf http://www.jst-mfg.com/product/detail.php?series=272
D1 = SparkFun-DiscreteSemi:DIODE-ZENER: Zener Diode A Zener diode allows current to flow from its anode to its cathode like a normal semiconductor diode, but it also permits current to flow in the reverse direction when its "Zener voltage" is reached. - WIkipedia; PROD_ID: DIO-11284; VALUE: 3.3V
D2-D9 = SparkFun-DiscreteSemi:BAV99: Series-pair diode array Two small signal silicon diodes connected anode to cathode. Connections to all three nodes available. Link to datasheet <https://www.fairchildsemi.com/datasheets/BA/BAV99.pdf> SparkFun Products: SparkFun AutoDriver <https://www.sparkfun.com/products/13752>; PROD_ID: DIO-10647; VALUE: 200mA/70V
FD1-FD3 = SparkFun-Aesthetics:FIDUCIAL: Fiducial Alignment Points Various fiducial points for machine vision alignment.
FLAG1-FLAG8 = SparkFun-LED:LED-RED: Assorted Red LEDs LilyPad 1206- DIO-09912 1206- DIO-00809 0603- DIO-00819 "SMART" means more efficient and expensive; PROD_ID: DIO-00819
IC1 = P78E05-1000:P78E05-1000: NON-ISOLATED DC SWITCHING REGULATOR; CUI_PURCHASE_URL: https://www.cui.com/product/dc-dc-converters/non-isolated/p78e-1000-series?utm_source=snapeda.com&utm_medium=referral&utm_campaign=snapedaBOM; DESCRIPTION: 1 A Output Current, 6~36 Vdc Input, 3 Pin SIP, Non-Isolated, Dc-Dc Converter; DIGI-KEY_PART_NUMBER: 102-5018-ND; DIGI-KEY_PURCHASE_URL: https://www.digikey.jp/product-detail/en/cui-inc/P78E05-1000/102-5018-ND/9649654?utm_source=snapeda&utm_medium=aggregator&utm_campaign=symbol; MF: CUI Inc.; MP: P78E05-1000; PACKAGE: SIP-3 CUI Inc.
IC2 = _kantaParts:0982_W5500: The W5500 chip is a Hardwired TCP/IP embedded Ethernet controller that enables easier internet connection for embedded systems using SPI (Serial Peripheral Interface). Case TQFP48
ID = switch-dil:219-08*: Surface Mount DIP Switch Series 219 SMT CTS Electronic Components Sourc: www.ctscorp.com; OC_FARNELL: unknown; OC_NEWARK: unknown
J1 = _kantaParts:USB: Library: MF_Connectors Description: 5 Pin USB Connectors. SLD is the shield connection. Usually tied to ground through a small ferrite bead.
J2 = SamacSys_Parts:DM3AT-SF-PEJM5(42): Memory Card Connectors SD R/A PUSH-PUSH SMD CONN MICRO Source: Datasheet <https://www.hirose.com/product/document?clcode=CL0609-0031-0-00&productname=DM3AT-SF-PEJM5&series=DM3&documenttype=2DDrawing&lang=en&documentid=0000947170>; DESCRIPTION: Memory Card Connectors SD R/A PUSH-PUSH SMD CONN MICRO; HEIGHT: 1.83mm; MANUFACTURER_NAME: Hirose; MANUFACTURER_PART_NUMBER: DM3AT-SF-PEJM5(42); MOUSER_PART_NUMBER: 798-DM3AT-SF-PEJM542; MOUSER_PRICE-STOCK: https://www.mouser.com/Search/Refine.aspx?Keyword=798-DM3AT-SF-PEJM542
J3-J10 = 691321300004:691321300004: WR-TBL Serie 321 - 3.81mm Vertical PCB Header , 4 Pins=>Code : Con_TBL_Pluggable_3.81_PCB_THT_Simple_691321300004 <http://katalog.we-online.de/media/images/eican/Con_TBL_Pluggable_3.81_PCB_THT_Simple_6913213000xx_pf2.jpg> Details see: http://katalog.we-online.de/en/em/TBL_3_81_321_VERTICAL_PCB_HEADER_6913213000XX Created 2014-06-19, Karrer Zheng 2014 (C) Würth Elektronik; AVAILABILITY: Unavailable; DESCRIPTION: 321; 3.81mm Pitch Straight Pluggable Term Block, PCB Header, Through Hole, 4 Way; MF: Wurth Electronics; MP: 691321300004; PACKAGE: None; PRICE: None
L = Seeed-LED:SMD-LED-CLEAR-BLUE(0603): 304090045; MPN: 19-217-BHC-ZL1M2RY-3T
L2 L3 = Seeed-Inductor:SMD-FERRITE-BEAD-330R-1500MA(0805): 303030006; MPN: BLM21PG331SN1D
Q1 = _kantaParts:CRYSTAL: CRYSTAL
Q2 = transistor-fet:FDD4141: P-Channel PowerTrench® MOSFET Source: FDD4141.pdf
Q3 = _kantaParts:CRYSTAL_OSC
R1 R4 = Seeed-Resistor:SMD-RES-10K-5%-1/10W(0603): 301010293; MPN: RC0603JR-0710KL
R2 = Seeed-Resistor:SMD-RES-100K-5%-1/10W(0603): 301010089; MPN: RC0603JR-07100KL
R3 = Seeed-Resistor:SMD-RES-12K-1%-1/10W(0603): 301010102; MPN: RC0603FR-0712KL; VALUE: 12K
R5 = Seeed-Resistor:SMD-RES-1M-5%-1/10W(0603): 301010100; MPN: RC0603JR-071ML
R6 = Seeed-Resistor:SMD-RES-10R-5%-1/10W(0603): 301010096; MPN: RC0603JR-0710RL
R7 R8 = Seeed-Resistor:SMD-RES-330R-1%-1/10W(0603): 301010300; MPN: RC0603FR-07330RL
R9-R16 = Seeed-Resistor:SMD-RES-100R-5%-1/10W(0603): 301010090; MPN: RC0603JR-07100RL
RESET = SparkFun-Electromechanical:SWITCH-MOMENTARY-2: Various NO switches- pushbuttons, reed, etc; PROD_ID: SWCH-08247
RN1-RN9 = _kantaParts:4R-N: Array Chip Resistor Source: RS Component / Phycomp
RX = Seeed-LED:LED-SMD-RED-DIFFUSED(0603): 304090042; MPN: 19-217-R6C-AL1M2VY-3T
S3 = SparkFun-Switches:MOMENTARY-SWITCH-SPST: Momentary Switch (Pushbutton) - SPST Normally-open (NO) SPST momentary switches (buttons, pushbuttons). Variants PTH-12MM - 12mm square, through-hole Momentary Pushbutton Switch - 12mm Square <https://www.sparkfun.com/products/9190> (COM-09190) PTH-6.0MM, PTH-6.0MM-KIT - 6.0mm square, through-hole Mini Pushbutton Switch <https://www.sparkfun.com/products/97> (COM-00097) KIT package intended for soldering kit's - only one side of pads' copper is exposed. PTH-RIGHT-ANGLE-KIT - Right-angle, through-hole Right Angle Tactile Button <https://www.sparkfun.com/products/10791> - Used on SparkFun BigTime Watch Kit <https://www.sparkfun.com/products/11734> SMD-12MM - 12mm square, surface-mount Tactile Button - SMD (12mm) <https://www.sparkfun.com/products/12993> (COM-12993) Used on SparkFun PicoBoard <https://www.sparkfun.com/products/11888> SMD-4.5MM - 4.5mm Square Trackball Switch Used on SparkFun Blackberry Trackballer Breakout <https://www.sparkfun.com/products/13169> SMD-4.6MMX2.8MM - 4.60mm x 2.80mm, surface mount Used on SparkFun SAMD21 Mini Breakout <https://www.sparkfun.com/products/13664> SMD-5.2MM, SMD-5.2-REDUNDANT - 5.2mm square, surface-mount Mini Pushbutton Switch - SMD <https://www.sparkfun.com/products/8720> (COM-08720) Used on Arduino Pro Mini <https://www.sparkfun.com/products/11114> REDUNDANT package connects both switch circuits together SMD-6.0X3.5MM - 6.0 x 3.5mm, surface mount Momentary Reset Switch SMD <https://www.sparkfun.com/products/8229> (COM-08229) SMD-6.2MM-TALL - 6.2mm square, surface mount Tactile Button - SMD (6mm) <https://www.sparkfun.com/products/12992> Used on SparkFun Digital Sandbox <https://www.sparkfun.com/products/12651> SMD-RIGHT-ANGLE - Right-angle, surface mount Used on SparkFun Block for Intel® Edison - Arduino <https://www.sparkfun.com/products/13036>; PROD_ID: SWCH-11966; SF_SKU: COM-12992
S4-S7 = SparkFun-Electromechanical:STANDOFF_ELECTRICAL: A standoff intended to be an electrically connected point. Pad size and stop size allow for a #4 Phillips pan screw head to make a solid connection to the board.
SWD = _kantaParts:CORTEX_DEBUG
TP1-TP18 = SparkFun-Connectors:TEST-POINT: SparkFun Test Points Bare copper test points for troubleshooting or In-Circuit-Testing. These are used by our Production team for verifying production board runs using pogo-pins on test beds. SparkFun Products: SparkFun LSM9DS1 Breakout <https://www.sparkfun.com/products/13284> SparkFun PSOC <https://www.sparkfun.com/products/13714> SparkFun Load Cell Amplifier <https://www.sparkfun.com/products/13879>
TX = Seeed-LED:SMD-LED-CLEAR-YELLOW(0603): 304090044; MPN: 19-217-Y5C-AM1N1VY-3T
U1 U3 U4 = IC:74*165: 8-bit parallel-in/serial out shift register http://www.nxp.com/documents/data_sheet/74HC_HCT165.pdf
U2 = _kantaParts:USBLC6: STMicroelectronics USBLC6 VERY LOW CAPACITANCE ESD PROTECTION RS 624-7693 <http://jp.rs-online.com/web/p/tvs/6247693/>
U5 = samd21-temp:ATSAMD21G: Atmel SAMD21G SMART ARM-Based Microcontroller The Atmel ® | SMART ™ SAM D21 is a series of low-power microcontrollers using the 32-bit ARM ® Cortex ® -M0+ processor, and ranging from 32- to 64-pins with up to 256KB Flash and 32KB of SRAM. The SAM D21 devices operate at a maximum frequency of 48MHz and reach 2.46 CoreMark/MHz. They are designed for simple and intuitive migration with identical peripheral modules, hex compatible code, identical linear address map and pin compatible migration paths between all devices in the product series. All devices include intelligent and flexible peripherals, Atmel Event System for inter-peripheral signaling, and support for capacitive touch button, slider and wheel user interfaces.; PROD_ID: IC-13064
U6 = SparkFun-IC-Power:V_REG_LM1117: Voltage Regulator LM1117 Standard adjustable voltage regulator but in SMD form. Spark Fun Electronics SKU : COM-00595; PROD_ID: VREG-08170
U7-U14 = _kantaParts:L6470
X1 = _kantaParts:M04: Round Pin Socket with slim pads Akiduki P-01015 <http://akizukidenshi.com/catalog/g/gP-01015/>
X2 = SmartPrj:CRYSTAL-3.2-2.5
X3 = _kantaParts:RJ45_MAGNETICS_LED